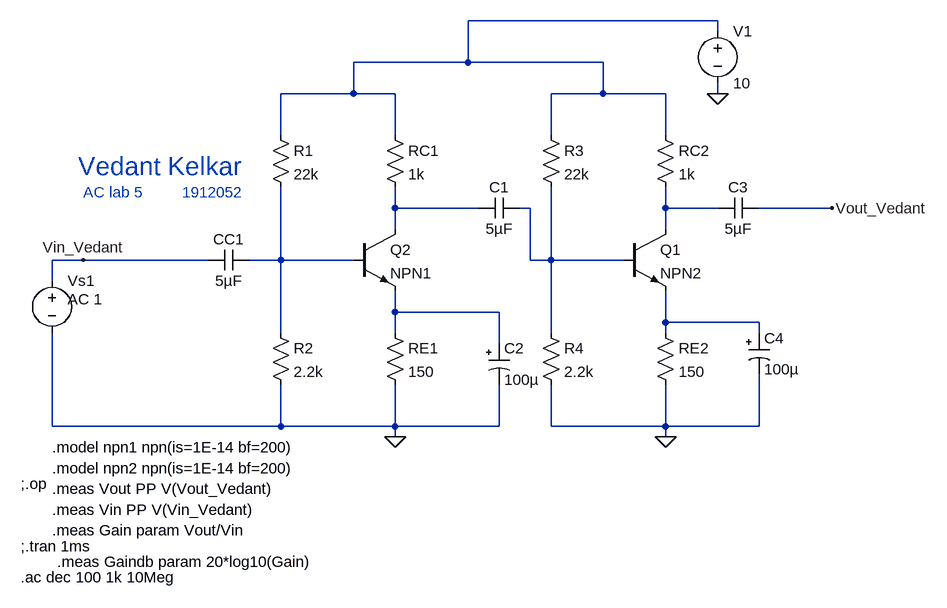
[diagram p0: schematic Draft48.asc]
Draft48.asc, the LTspice schematic file:
Version 4
SHEET 1 888 680
WIRE 544 -272 160 -272
WIRE 544 -256 544 -272
WIRE 160 -208 160 -272
WIRE 160 -208 -16 -208
WIRE 368 -208 160 -208
WIRE -16 -160 -16 -208
WIRE -16 -160 -128 -160
WIRE 48 -160 -16 -160
WIRE 368 -160 368 -208
WIRE 368 -160 288 -160
WIRE 464 -160 368 -160
WIRE 544 -160 544 -176
WIRE -128 -96 -128 -160
WIRE 48 -96 48 -160
WIRE 288 -96 288 -160
WIRE 464 -96 464 -160
WIRE 48 16 48 -16
WIRE 176 16 48 16
WIRE 256 16 240 16
WIRE 464 16 464 -16
WIRE 544 16 464 16
WIRE 720 16 608 16
WIRE 48 48 48 16
WIRE 464 48 464 16
WIRE -432 96 -480 96
WIRE -240 96 -432 96
WIRE -128 96 -128 -16
WIRE -128 96 -176 96
WIRE -16 96 -128 96
WIRE 256 96 256 16
WIRE 288 96 288 -16
WIRE 288 96 256 96
WIRE 400 96 288 96
WIRE -480 128 -480 96
WIRE 48 176 48 144
WIRE 208 176 48 176
WIRE 464 192 464 144
WIRE 608 192 464 192
WIRE -128 208 -128 96
WIRE 48 208 48 176
WIRE 288 208 288 96
WIRE 464 208 464 192
WIRE 608 208 608 192
WIRE 208 224 208 176
WIRE -480 352 -480 208
WIRE -128 352 -128 288
WIRE -128 352 -480 352
WIRE 48 352 48 288
WIRE 48 352 -128 352
WIRE 208 352 208 288
WIRE 208 352 48 352
WIRE 288 352 288 288
WIRE 464 352 464 288
WIRE 464 352 288 352
WIRE 608 352 608 272
WIRE 608 352 464 352
WIRE 48 368 48 352
WIRE 464 368 464 352
FLAG 48 368 0
FLAG 464 368 0
FLAG 544 -160 0
FLAG -432 96 Vin_Vedant
FLAG 720 16 Vout_Vedant
SYMBOL res -144 -112 R0
SYMATTR InstName R1
SYMATTR Value 22k
SYMBOL res 32 -112 R0
SYMATTR InstName RC1
SYMATTR Value 1k
SYMBOL res 32 192 R0
SYMATTR InstName RE1
SYMATTR Value 150
SYMBOL res -144 192 R0
SYMATTR InstName R2
SYMATTR Value 2.2k
SYMBOL npn 400 48 R0
SYMATTR InstName Q1
SYMATTR Value NPN2
SYMBOL cap -176 80 R90
WINDOW 0 0 32 VBottom 2
WINDOW 3 32 32 VTop 2
SYMATTR InstName CC1
SYMATTR Value 5µF
SYMBOL voltage -480 112 R0
WINDOW 123 24 44 Left 2
WINDOW 39 0 0 Left 0
WINDOW 3 24 44 Left 2
SYMATTR Value2 AC 1
SYMATTR Value ""
SYMATTR InstName Vs1
SYMBOL cap 240 0 R90
WINDOW 0 0 32 VBottom 2
WINDOW 3 32 32 VTop 2
SYMATTR InstName C1
SYMATTR Value 5µF
SYMBOL polcap 192 224 R0
WINDOW 3 24 56 Left 2
SYMATTR Value 100µ
SYMATTR InstName C2
SYMATTR Description Capacitor
SYMATTR Type cap
SYMATTR SpiceLine V=4 Irms=3.72678 Rser=0.018 Lser=0 mfg="KEMET" pn="A700D107M004ATE018" type="Al electrolytic"
SYMBOL res 272 -112 R0
SYMATTR InstName R3
SYMATTR Value 22k
SYMBOL res 272 192 R0
SYMATTR InstName R4
SYMATTR Value 2.2k
SYMBOL res 448 -112 R0
SYMATTR InstName RC2
SYMATTR Value 1k
SYMBOL res 448 192 R0
SYMATTR InstName RE2
SYMATTR Value 150
SYMBOL npn -16 48 R0
SYMATTR InstName Q2
SYMATTR Value NPN1
SYMBOL cap 608 0 R90
WINDOW 0 0 32 VBottom 2
WINDOW 3 32 32 VTop 2
SYMATTR InstName C3
SYMATTR Value 5µF
SYMBOL polcap 592 208 R0
WINDOW 3 24 56 Left 2
SYMATTR Value 100µ
SYMATTR InstName C4
SYMATTR Description Capacitor
SYMATTR Type cap
SYMATTR SpiceLine V=4 Irms=3.72678 Rser=0.018 Lser=0 mfg="KEMET" pn="A700D107M004ATE018" type="Al electrolytic"
SYMBOL voltage 544 -272 R0
WINDOW 123 0 0 Left 0
WINDOW 39 0 0 Left 0
SYMATTR InstName V1
SYMATTR Value 10
TEXT -440 -48 Left 4 ;Vedant Kelkar
TEXT -432 -8 Left 2 ;AC lab 5
TEXT -280 -8 Left 2 ;1912052
TEXT -480 384 Left 2 !.model npn1 npn(is=1E-14 bf=200)
TEXT -480 416 Left 2 !.model npn2 npn(is=1E-14 bf=200)
TEXT -528 440 Left 2 !;.op
TEXT -480 448 Left 2 !.meas Vout PP V(Vout_Vedant)
TEXT -480 480 Left 2 !.meas Vin PP V(Vin_Vedant)
TEXT -480 512 Left 2 !.meas Gain param Vout/Vin
TEXT -528 536 Left 2 !;.tran 1ms
TEXT -472 560 Left 2 !.meas Gaindb param 20*log10(Gain)
TEXT -528 584 Left 2 !.ac dec 100 1k 10Meg

The netlist it stands for:
* Draft48.asc
R1 N001 N005 22k
RC1 N001 N002 1k
RE1 N006 0 150
R2 N005 0 2.2k
Q1 N004 N003 N007 0 NPN2
CC1 N005 Vin_Vedant 5µF
Vs1 Vin_Vedant 0 AC 1
C1 N003 N002 5µF
C2 N006 0 100µ V=4 Irms=3.72678 Rser=0.018 Lser=0 mfg="KEMET" pn="A700D107M004ATE018" type="Al electrolytic"
R3 N001 N003 22k
R4 N003 0 2.2k
RC2 N001 N004 1k
RE2 N007 0 150
Q2 N002 N005 N006 0 NPN1
C3 Vout_Vedant N004 5µF
C4 N007 0 100µ V=4 Irms=3.72678 Rser=0.018 Lser=0 mfg="KEMET" pn="A700D107M004ATE018" type="Al electrolytic"
V1 N001 0 10
.model NPN NPN
.model PNP PNP
.lib standard.bjt
* Vedant Kelkar
* AC lab 5
* 1912052
.model npn1 npn(is=1E-14 bf=200)
.model npn2 npn(is=1E-14 bf=200)
;.op
.meas Vout PP V(Vout_Vedant)
.meas Vin PP V(Vin_Vedant)
.meas Gain param Vout/Vin
;.tran 1ms
.meas Gaindb param 20*log10(Gain)
.ac dec 100 1k 10Meg
.backanno
.end